# EAGLE schematic Circuito eletrico (EAGLE 9.7.0)
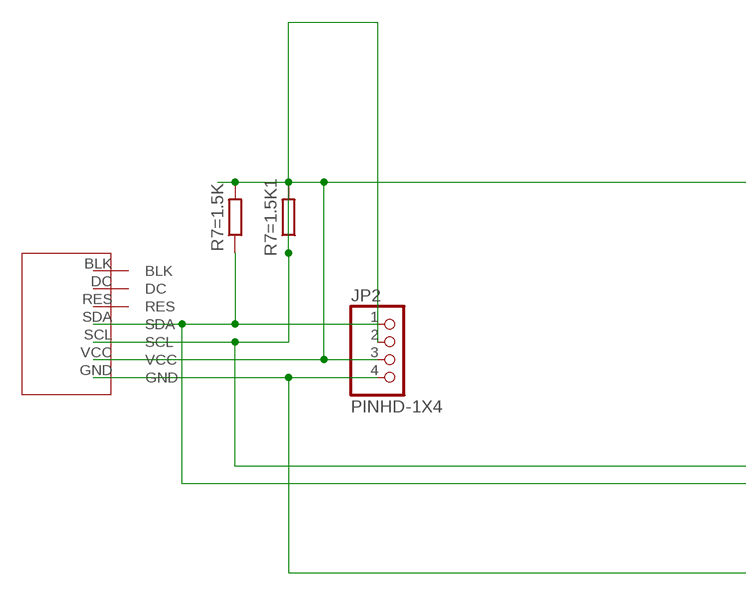
[diagram p0: schematic, sheet 1, part 1 of 2]
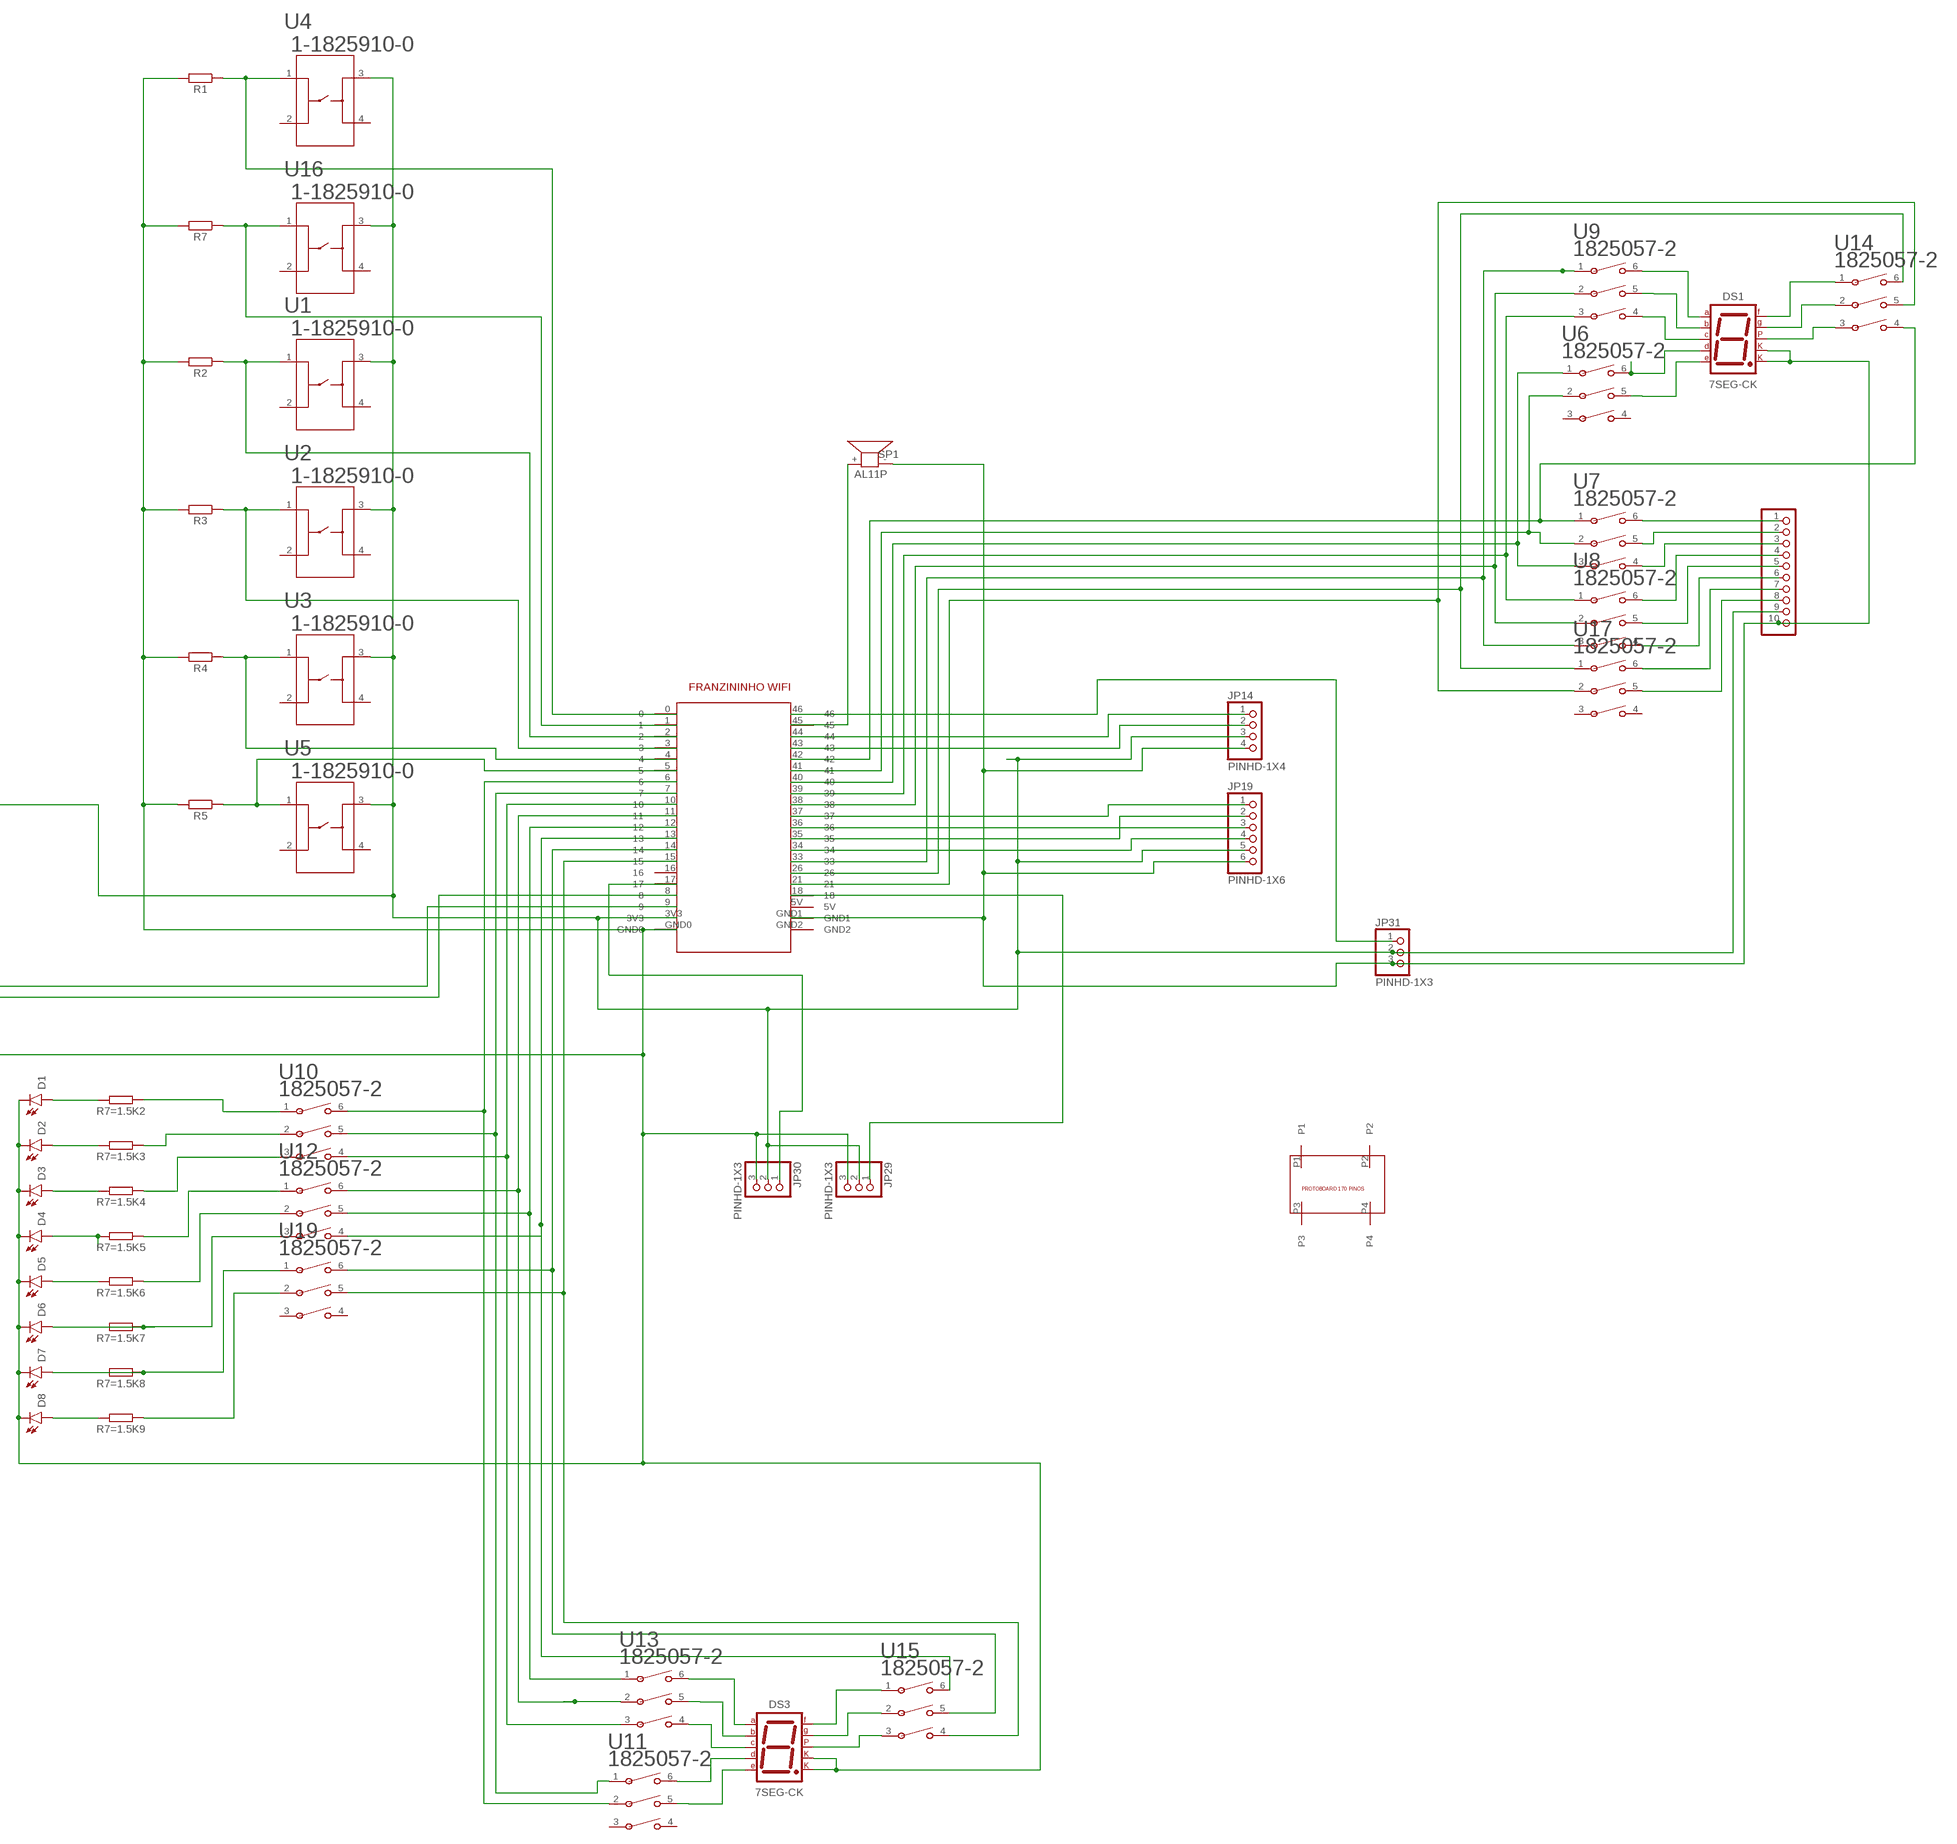
[diagram p1: schematic, sheet 1, part 2 of 2]

## Parts
D1  LED_RADIAL  [LEDRD254W60D565H860B_W_V1]
D2  LED_RADIAL  [LEDRD254W60D565H860B_W_V1]
D3  LED_RADIAL  [LEDRD254W60D565H860B_W_V1]
D4  LED_RADIAL  [LEDRD254W60D565H860B_W_V1]
D5  LED_RADIAL  [LEDRD254W60D565H860B_W_V1]
D6  LED_RADIAL  [LEDRD254W60D565H860B_W_V1]
D7  LED_RADIAL  [LEDRD254W60D565H860B_W_V1]
D8  LED_RADIAL  [LEDRD254W60D565H860B_W_V1]
DS1  7SEG-CK  [7SEG-13]
DS3  7SEG-CK  [7SEG-13]
JP2  PINHD-1X4  [1X04]
JP9  PINHD-1X10  [1X10]
JP14  PINHD-1X4  [1X04]
JP19  PINHD-1X6  [1X06]
JP29  PINHD-1X3  [1X03]
JP30  PINHD-1X3  [1X03]
JP31  PINHD-1X3  [1X03]
R1  R_AXIAL-11.7MM-PITCH  [RESAD1176W63L850D250B]
R2  R_AXIAL-11.7MM-PITCH  [RESAD1176W63L850D250B]
R3  R_AXIAL-11.7MM-PITCH  [RESAD1176W63L850D250B]
R4  R_AXIAL-11.7MM-PITCH  [RESAD1176W63L850D250B]
R5  R_AXIAL-11.7MM-PITCH  [RESAD1176W63L850D250B]
R7  R_AXIAL-11.7MM-PITCH  [RESAD1176W63L850D250B]
R7=1.5K  R_AXIAL-11.7MM-PITCH  [RESAD1176W63L850D250B]
R7=1.5K1  R_AXIAL-11.7MM-PITCH  [RESAD1176W63L850D250B]
R7=1.5K2  R_AXIAL-11.7MM-PITCH  [RESAD1176W63L850D250B]
R7=1.5K3  R_AXIAL-11.7MM-PITCH  [RESAD1176W63L850D250B]
R7=1.5K4  R_AXIAL-11.7MM-PITCH  [RESAD1176W63L850D250B]
R7=1.5K5  R_AXIAL-11.7MM-PITCH  [RESAD1176W63L850D250B]
R7=1.5K6  R_AXIAL-11.7MM-PITCH  [RESAD1176W63L850D250B]
R7=1.5K7  R_AXIAL-11.7MM-PITCH  [RESAD1176W63L850D250B]
R7=1.5K8  R_AXIAL-11.7MM-PITCH  [RESAD1176W63L850D250B]
R7=1.5K9  R_AXIAL-11.7MM-PITCH  [RESAD1176W63L850D250B]
SP1  AL11P  [AL11P]
U1  1-1825910-0  [SWITCH_1-1825910-0]
U2  1-1825910-0  [SWITCH_1-1825910-0]
U3  1-1825910-0  [SWITCH_1-1825910-0]
U4  1-1825910-0  [SWITCH_1-1825910-0]
U5  1-1825910-0  [SWITCH_1-1825910-0]
U6  1825057-2  [SWDIP6_300X138P100]
U7  1825057-2  [SWDIP6_300X138P100]
U8  1825057-2  [SWDIP6_300X138P100]
U9  1825057-2  [SWDIP6_300X138P100]
U10  1825057-2  [SWDIP6_300X138P100]
U11  1825057-2  [SWDIP6_300X138P100]
U12  1825057-2  [SWDIP6_300X138P100]
U13  1825057-2  [SWDIP6_300X138P100]
U14  1825057-2  [SWDIP6_300X138P100]
U15  1825057-2  [SWDIP6_300X138P100]
U16  1-1825910-0  [SWITCH_1-1825910-0]
U17  1825057-2  [SWDIP6_300X138P100]
U19  1825057-2  [SWDIP6_300X138P100]
U$1  FRANZINO_WIFI  [FRANZININHO_WIFI]
U$2  DISPLAY_TFT_SPI  [PERIMETRO_DISPLAY_TFT]
U$3  PROTOBOARD_170_PINOS  [PROTOBOARD_170_PINOS]

## Nets
N$1: SP1.+ U$1.45
N$2: U6.2 U7.2 U$1.41
N$3: U15.4 U19.5 U$1.15
N$4: JP19.3 U$1.36
N$5: JP14.1 U$1.44
N$6: JP19.1 U$1.37
N$7: U7.1 U14.4 U$1.42
N$8: R1.1 U4.1 U$1.0
N$9: JP2.3 JP9.9 JP14.3 JP19.5 JP29.2 JP30.2 JP31.2 R7=1.5K1.2 R7=1.5K.2 U1.3 U2.3 U3.3 U4.3 U5.3 U16.3 U$1.3V3 U$2.VCC
N$10: R7.1 U16.1 U$1.1
N$11: R2.1 U1.1 U$1.2
N$12: JP14.2 U$1.43
N$13: JP19.2 U$1.35
N$14: DS1.2(D) U6.6
N$15: JP2.1 R7=1.5K.1 U$1.8 U$2.SDA
N$16: JP19.4 U$1.34
N$17: DS1.1(E) U6.5
N$18: JP31.1 U$1.46
N$20: R3.1 U2.1 U$1.3
N$21: U8.3 U9.1 U$1.33
N$22: JP29.1 U$1.18
N$23: U6.1 U7.3 U$1.40
N$24: JP9.2 U7.5
N$26: U8.1 U9.3 U$1.39
N$32: D1.1(A) R7=1.5K2.1
N$33: D2.1(A) R7=1.5K3.1
N$34: D3.1(A) R7=1.5K4.1
N$35: D4.1(A) R7=1.5K5.1
N$36: D5.1(A) R7=1.5K6.1
N$37: D6.1(A) R7=1.5K7.1
N$38: D7.1(A) R7=1.5K8.1
N$39: D8.1(A) R7=1.5K9.1
N$40: R7=1.5K2.2 U10.1
N$42: JP9.1 U7.6
N$43: JP9.3 U7.4
N$44: JP9.4 U8.6
N$45: R7=1.5K7.2 U12.3
N$46: R7=1.5K8.2 U19.1
N$47: JP9.5 U8.5
N$51: U14.6 U17.1 U$1.26
N$52: U14.5 U17.2 U$1.21
N$53: DS1.9(F) U14.1
N$54: DS1.7(A) U9.6
N$55: DS1.4(C) U9.4
N$56: R4.1 U3.1 U$1.4
N$57: U8.2 U9.2 U$1.38
N$62: R5.1 U5.1 U$1.5
N$63: D1.2(C) D2.2(C) D3.2(C) D4.2(C) D5.2(C) D6.2(C) D7.2(C) D8.2(C) DS3.3(CK1) DS3.8(CK2) JP2.4 JP29.3 JP30.3 R1.2 R2.2 R3.2 R4.2 R5.2 R7.2 U$1.GND0 U$2.GND
N$64: DS1.10(G) U14.2
N$65: JP30.1 U$1.17
N$66: DS1.6(B) U9.5
N$67: DS1.5(DP) U14.3
N$68: DS1.3(CK1) DS1.8(CK2) JP9.10 JP14.4 JP19.6 JP31.3 SP1.- U$1.GND1
N$69: DS3.2(D) U11.6
N$70: DS3.1(E) U11.5
N$71: JP2.2 R7=1.5K1.1 U$1.9 U$2.SCL
N$72: R7=1.5K3.2 U10.2
N$74: R7=1.5K4.2 U10.3
N$75: R7=1.5K5.2 U12.1
N$76: R7=1.5K6.2 U12.2
N$78: U10.5 U11.1 U$1.7
N$80: R7=1.5K9.2 U19.2
N$82: U12.6 U13.2 U$1.11
N$83: U12.5 U13.1 U$1.12
N$84: U12.4 U15.6 U$1.13
N$85: U15.5 U19.6 U$1.14
N$87: U10.4 U13.3 U$1.10
N$88: JP9.6 U8.4
N$89: JP9.7 U17.6
N$90: JP9.8 U17.5
N$91: U10.6 U11.2 U$1.6
N$94: DS3.6(B) U13.5
N$95: DS3.7(A) U13.6
N$96: DS3.4(C) U13.4
N$97: DS3.9(F) U15.1
N$98: DS3.10(G) U15.2
N$99: DS3.5(DP) U15.3
Unconnected: U1.2 U1.4 U2.2 U2.4 U3.2 U3.4 U4.2 U4.4 U5.2 U5.4 U6.3 U6.4 U11.3 U11.4 U16.2 U16.4 U17.3 U17.4 U19.3 U19.4 U$1.5V U$1.16 U$1.GND2 U$2.BLK U$2.DC U$2.RES U$3.P1 U$3.P2 U$3.P3 U$3.P4

## Library data of the parts
D1-D8 = Lib_Opto_Eletronic_Led_Verde:LED_RADIAL: LED - Generic
DS1 DS3 = Opto-Electronic:7SEG-CK: 7-segment DISPLAY single cathode, 13 mm; CATEGORY: Opto-Electronic; SUB-CATEGORY: Display; TYPE: 7-Segment
JP2 JP14 = Connector:PINHD-1X4: PIN HEADER; CATEGORY: CONNECTOR; SUB-CATEGORY: PIN-HEADER
JP9 = Connector:PINHD-1X10: PIN HEADER; CATEGORY: CONNECTOR; SUB-CATEGORY: PIN-HEADER
JP19 = Connector:PINHD-1X6: PIN HEADER; CATEGORY: CONNECTOR; SUB-CATEGORY: PIN-HEADER
JP29-JP31 = Connector:PINHD-1X3: PIN HEADER; CATEGORY: CONNECTOR; SUB-CATEGORY: PIN-HEADER
R1-R5 R7 R7=1.5K R7=1.5K1-R7=1.5K9 = Resistor:R: Resistor Fixed - Generic; CATEGORY: Resistor; SUB-CATEGORY: Fixed
SP1 = buzzer:AL11P: SPEAKER Source: Buerklin; OC_FARNELL: unknown; OC_NEWARK: unknown
U1-U5 U16 = Switches:1-1825910-0; BUILT_BY: EMA_UL_Team; CATEGORY: Tactile Switches; COPYRIGHT: Copyright (C) 2016 Accelerated Designs. All rights reserved; DESCRIPTION: FSM6JH=6MM TACT SWITCH, HIGH TEMP; MANUFACTURER_PART_NUMBER: 1-1825910-0; PART_STATUS: active; SERIES: Unknown; VENDOR: TE Connectivity
U6-U15 U17 U19 = Switches:1825057-2; BUILT_BY: EMA_UL_Team; CATEGORY: DIP & SIP Switches; COPYRIGHT: Copyright (C) 2016 Accelerated Designs. All rights reserved; DESCRIPTION: ADE0304=DIP SWITCH,EXT,THRU/HL; MANUFACTURER_PART_NUMBER: 1825057-2; PART_STATUS: active; SERIES: Alcoswitch DIP,Alcoswitch DIP ADE; VENDOR: TE Connectivity
U$1 = biblioteca franzininho wifi:FRANZINO_WIFI
U$2 = biblioteca display tft:DISPLAY_TFT_SPI
U$3 = biblioteca protoboard 170 pinos:PROTOBOARD_170_PINOS